# Altium schematic sheet camera.SchDoc
size 226 x 157 mm
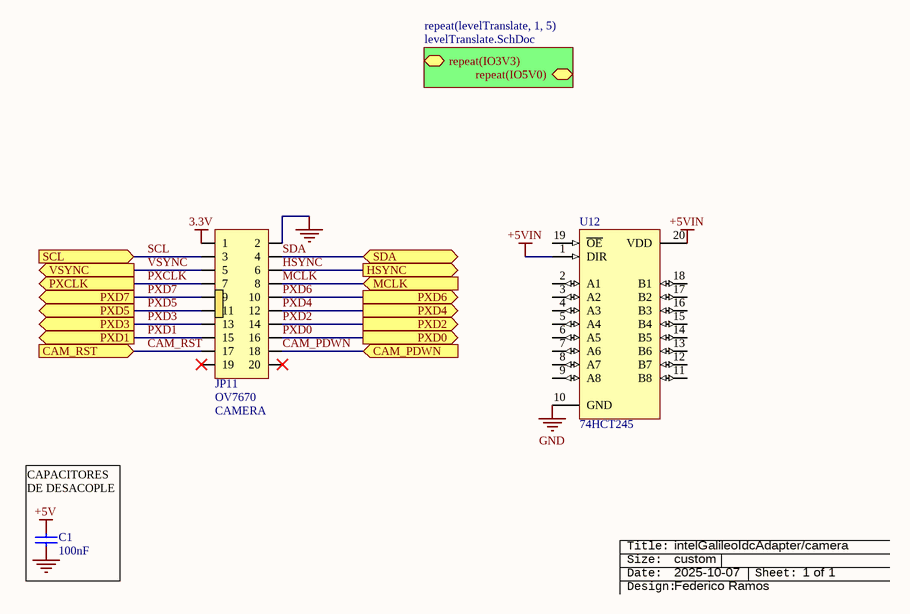
[diagram p0: camera.SchDoc]

## Parts
C1  value 100nF  [c1206]  (hidden comment: Cap)
JP11  MODULE: OV7670  NAME: CAMERA  [idc10x2]  (hidden comment: IDC 10x2)
ROT?  Rotulo_empty  (value not drawn)  (graphical)
U12  74HCT245  [DIP20Z]

## Sub-sheets
repeat(levelTranslate, 1, 5) = levelTranslate.SchDoc: repeat(IO3V3) (bidir), repeat(IO5V0) (bidir)

## Ports
CAM_PDWN (in), CAM_RST (in), HSYNC (out), MCLK (in), PXCLK (out), PXD0 (out), PXD1 (out), PXD2 (out), PXD3 (out), PXD4 (out), PXD5 (out), PXD6 (out), PXD7 (out), SCL (in), SDA (bidir), VSYNC (out)

## Nets
3.3V: JP11.1
+5V: C1.2
+5VIN: U12.1(DIR) U12.20(VDD)
GND: C1.1 JP11.2 U12.10(GND)
CAM_PDWN: JP11.18 ; port CAM_PDWN
CAM_RST: JP11.17 ; port CAM_RST
HSYNC: JP11.6 ; port HSYNC
MCLK: JP11.8 ; port MCLK
PXCLK: JP11.7 ; port PXCLK
PXD0: JP11.16 ; port PXD0
PXD1: JP11.15 ; port PXD1
PXD2: JP11.14 ; port PXD2
PXD3: JP11.13 ; port PXD3
PXD4: JP11.12 ; port PXD4
PXD5: JP11.11 ; port PXD5
PXD6: JP11.10 ; port PXD6
PXD7: JP11.9 ; port PXD7
SCL: JP11.3 ; port SCL
SDA: JP11.4 ; port SDA
VSYNC: JP11.5 ; port VSYNC

Not connected (* = marked no-connect by the designer): JP11 19* 20*; U12 2(A1) 3(A2) 4(A3) 5(A4) 6(A5) 7(A6) 8(A7) 9(A8) 11(B8) 12(B7) 13(B6) 14(B5) 15(B4) 16(B3) 17(B2) 18(B1) 19(~{OE})

## Notes on the sheet
- (near C1) CAPACITORES DE DESACOPLE
- intelGalileoIdcAdapter/camera
- custom
- 2025-10-07
- (near ROT?) 1 of 1
- Federico Ramos
- (in symbol Rotulo_empty) Title:; Size:; Date:; Sheet:; Design:

## Library data of the parts
C1 = Cap: Capacitor; Voltage: 50V; Price: 0.25; Technology: Ceramic
ROT? = Rotulo_empty: Rotulo [consolas]
U12 = 74HCT245: Octal 3-State Non-Inverting Bus Transceiver with LSTTL-Compatible Inputs